# Altium schematic sheet shoot2.SchDoc
size A
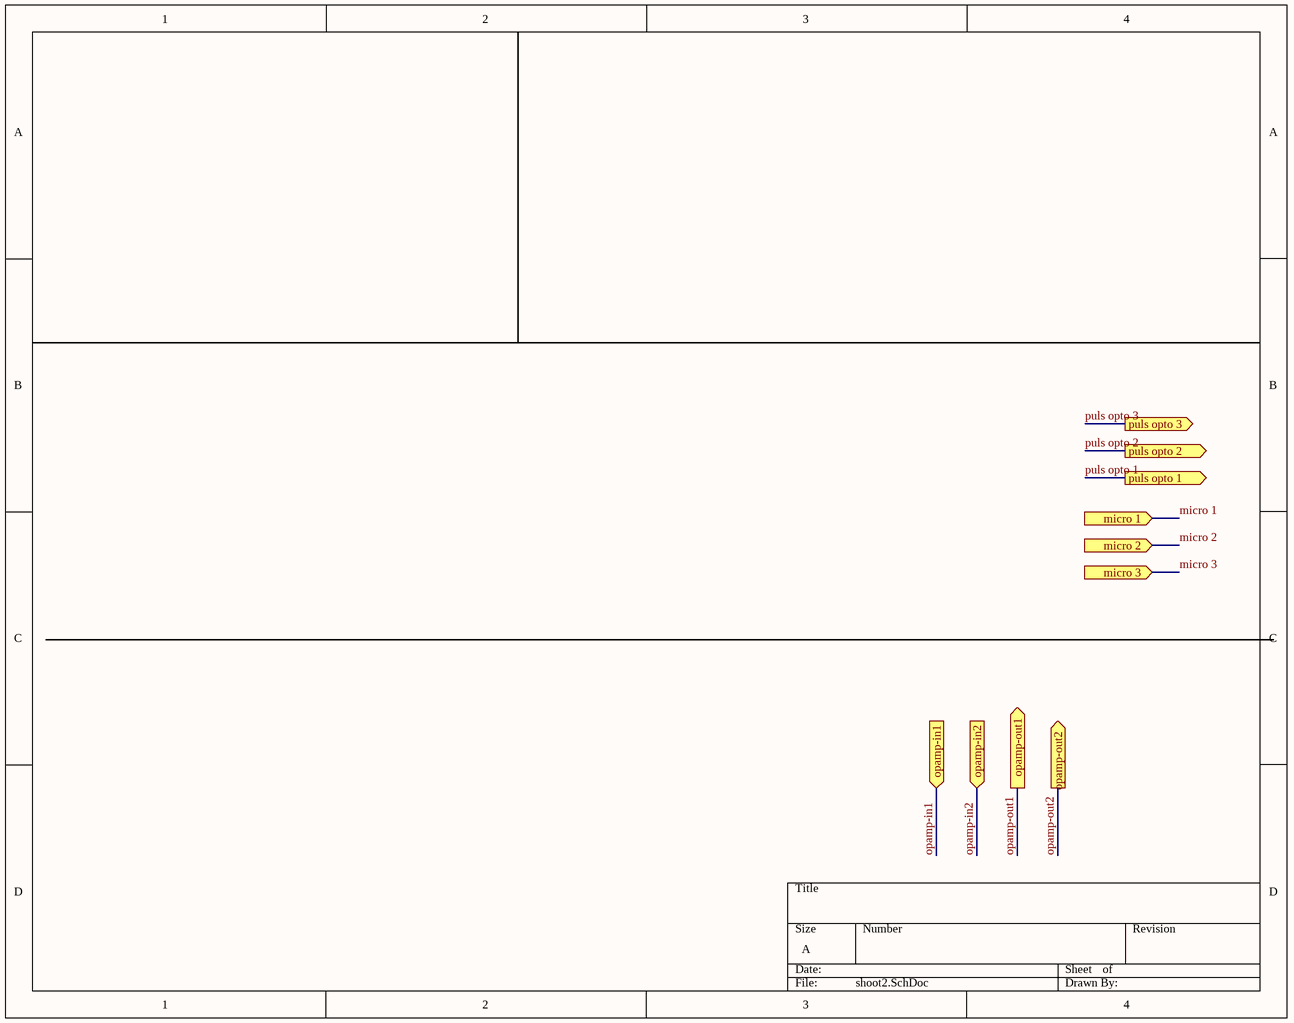
[diagram p0: shoot2.SchDoc]

## Ports
micro 1 (in), micro 2 (in), micro 3 (in), opamp-in1 (in), opamp-in2 (in), opamp-out1 (out), opamp-out2 (out), puls opto 1 (out), puls opto 2 (out), puls opto 3 (out)

## Nets
micro 1: port micro 1
micro 2: port micro 2
micro 3: port micro 3
opamp-in1: port opamp-in1
opamp-in2: port opamp-in2
opamp-out1: port opamp-out1
opamp-out2: port opamp-out2
puls opto 1: port puls opto 1
puls opto 2: port puls opto 2
puls opto 3: port puls opto 3